# EAGLE schematic NE556-CD4069-Synth-Toy (EAGLE 7.6.0)
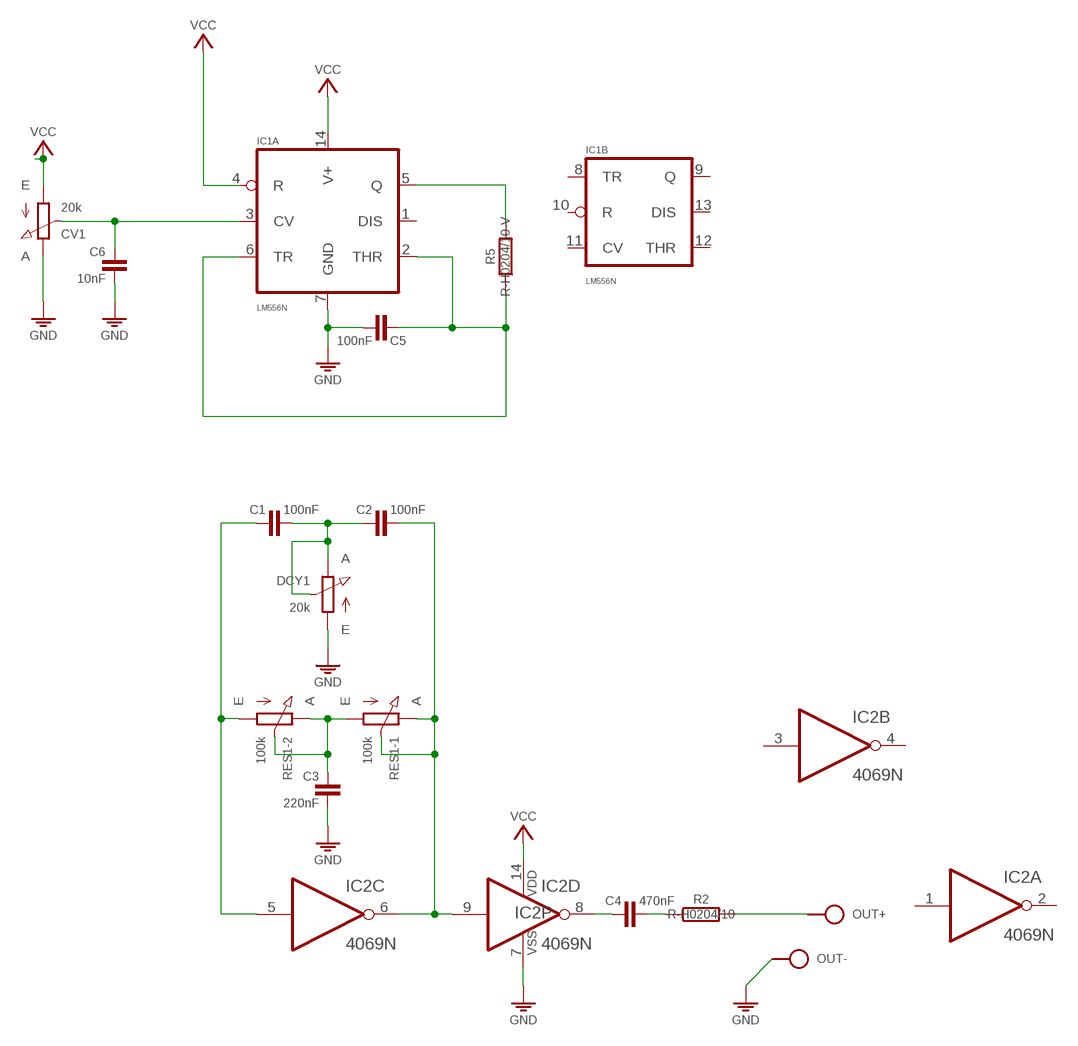
[diagram p0: schematic, sheet 1]

## Parts
C1  100nF  C-H050-024X044  [C050-024X044]
C2  100nF  C-H050-024X044  [C050-024X044]
C3  220nF  C050-020X044/V  [C050-020X044/V]
C4  470nF  C-H050-024X044  [C050-024X044]
C5  100nF  C-H050-020X044  [C050-020X044]
C6  10nF  C050-020X044/V  [C050-020X044/V]
CV1  20k  POT  [POT]
DCY1  20k  POT  [POT]
IC1  LM556N  [DIL14]
IC2  4069N  [DIL14]
OUT  SPAD+-+-  [SPAD+-]
R2  R-H0204/10  [0204/10]
R5  R-H0204/10-V  [0204/10-V]
RES1  100k  POT-STEREO  [POT-STEREO-2X3]
S3  VCC_GNDPWR-L  [PWR-L]

## Nets
GND: C3.2 C5.2 C6.2 CV1.E DCY1.A IC1.7(A:GND) IC2.7(P:VSS) OUT.1 S3.1
N$1: C2.2 IC2.6(C:O) IC2.9(D:I) RES1.1-E(-1:E) RES1.1-S(-1:S)
N$2: IC1.5(A:Q) R5.2
N$3: C4.2 R2.1
N$4: C3.1 RES1.1-A(-1:A) RES1.2-E(-2:E) RES1.2-S(-2:S)
N$5: C1.2 C2.1 DCY1.E DCY1.S
N$6: C4.1 IC2.8(D:O)
N$7: C1.1 IC2.5(C:I) RES1.2-A(-2:A)
N$8: C5.1 IC1.2(A:THR) IC1.6(A:TR) R5.1
N$9: C6.1 CV1.S IC1.3(A:CV)
N$10: OUT.2 R2.2
VCC: CV1.A IC1.4(A:R) IC1.14(A:V+) IC2.14(P:VDD) S3.2
Unconnected: IC1.1(A:DIS) IC1.8(B:TR) IC1.9(B:Q) IC1.10(B:R) IC1.11(B:CV) IC1.12(B:THR) IC1.13(B:DIS) IC2.1(A:I) IC2.2(A:O) IC2.3(B:I) IC2.4(B:O) IC2.10(E:O) IC2.11(E:I) IC2.12(F:O) IC2.13(F:I)

## Library data of the parts
C1 C2 C4 C5 = c:C-H
C3 C6 = c:C: CAPACITOR, European symbol
CV1 DCY1 = r:POT
IC1 = ic:*556: Dual Timer http://www.ti.com/lit/ds/symlink/lm556.pdf
IC2 = ic:4069: Hex INVERTER
OUT = pad:SPAD+-
R2 R5 = r:R-H
RES1 = r:POT-STEREO
S3 = pad:VCC_GND